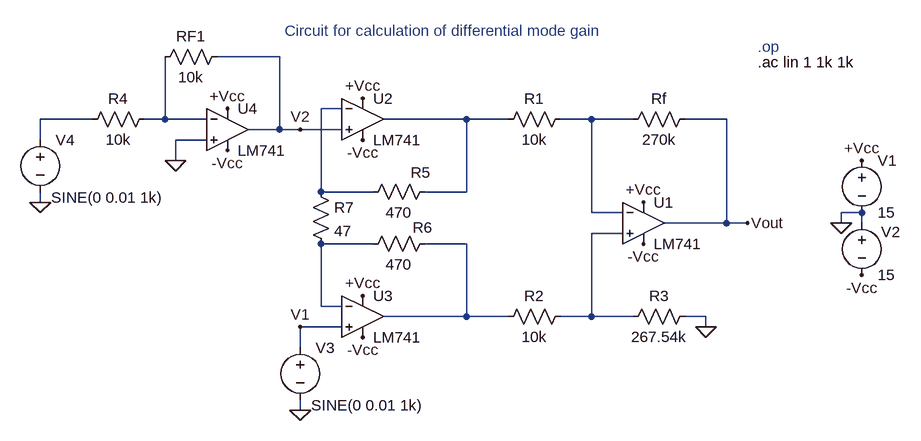
[diagram p0: schematic DMgain.asc]
DMgain.asc, the LTspice schematic file:
Version 4
SHEET 1 880 680
WIRE -384 -48 -480 -48
WIRE -288 32 -320 32
WIRE -672 48 -752 48
WIRE -560 48 -560 -48
WIRE -560 48 -592 48
WIRE -496 48 -560 48
WIRE -96 48 -224 48
WIRE -32 48 -96 48
WIRE 96 48 48 48
WIRE 160 48 96 48
WIRE 304 48 240 48
WIRE -384 64 -384 -48
WIRE -384 64 -432 64
WIRE -352 64 -384 64
WIRE -288 64 -352 64
WIRE -752 80 -752 48
WIRE -496 80 -544 80
WIRE -544 112 -544 80
WIRE -320 160 -320 32
WIRE -240 160 -320 160
WIRE -96 160 -96 48
WIRE -96 160 -160 160
WIRE -752 176 -752 160
WIRE 96 192 96 48
WIRE 144 192 96 192
WIRE 512 192 480 192
WIRE 304 208 304 48
WIRE 304 208 208 208
WIRE 336 208 304 208
WIRE 480 208 480 192
WIRE 512 208 512 192
WIRE 144 224 96 224
WIRE -240 240 -320 240
WIRE -96 240 -160 240
WIRE -320 336 -320 240
WIRE -288 336 -320 336
WIRE -96 352 -96 240
WIRE -96 352 -224 352
WIRE -32 352 -96 352
WIRE 96 352 96 224
WIRE 96 352 48 352
WIRE 160 352 96 352
WIRE 272 352 240 352
WIRE -288 368 -352 368
WIRE 272 368 272 352
WIRE -352 400 -352 368
WIRE -352 496 -352 480
FLAG 512 112 +Vcc
FLAG 512 288 -Vcc
FLAG 480 208 0
FLAG 272 368 0
FLAG 176 176 +Vcc
FLAG 176 240 -Vcc
FLAG 336 208 Vout
FLAG -256 16 +Vcc
FLAG -256 80 -Vcc
FLAG -256 320 +Vcc
FLAG -256 384 -Vcc
FLAG -352 496 0
FLAG -752 176 0
FLAG -464 32 +Vcc
FLAG -464 96 -Vcc
FLAG -544 112 0
FLAG -352 368 V1
FLAG -352 64 V2
SYMBOL voltage 512 96 R0
SYMATTR InstName V1
SYMATTR Value 15
SYMBOL voltage 512 192 R0
WINDOW 0 30 30 Left 2
SYMATTR InstName V2
SYMATTR Value 15
SYMBOL Opamps\\LM741 176 144 R0
SYMATTR InstName U1
SYMBOL res 64 32 R90
WINDOW 0 0 56 VBottom 2
WINDOW 3 32 56 VTop 2
SYMATTR InstName R1
SYMATTR Value 10k
SYMBOL res 64 336 R90
WINDOW 0 0 56 VBottom 2
WINDOW 3 32 56 VTop 2
SYMATTR InstName R2
SYMATTR Value 10k
SYMBOL res 256 336 R90
WINDOW 0 0 56 VBottom 2
WINDOW 3 32 56 VTop 2
SYMATTR InstName R3
SYMATTR Value 267.54k
SYMBOL res 256 32 R90
WINDOW 0 0 56 VBottom 2
WINDOW 3 32 56 VTop 2
SYMATTR InstName Rf
SYMATTR Value 270k
SYMBOL Opamps\\LM741 -256 -16 R0
SYMATTR InstName U2
SYMBOL Opamps\\LM741 -256 288 R0
SYMATTR InstName U3
SYMBOL res -144 144 R90
WINDOW 0 2 23 VBottom 2
WINDOW 3 32 56 VTop 2
SYMATTR InstName R5
SYMATTR Value 470
SYMBOL res -144 224 R90
WINDOW 0 6 20 VBottom 2
WINDOW 3 32 56 VTop 2
SYMATTR InstName R6
SYMATTR Value 470
SYMBOL res -336 144 R0
SYMATTR InstName R7
SYMATTR Value 47
SYMBOL voltage -352 384 R0
WINDOW 3 17 105 Left 2
WINDOW 39 0 0 Left 2
SYMATTR Value SINE(0 0.01 1k)
SYMATTR InstName V3
SYMATTR Value2 AC 0.01 0
SYMBOL voltage -752 64 R0
WINDOW 3 17 105 Left 2
WINDOW 39 0 0 Left 2
SYMATTR Value SINE(0 0.01 1k)
SYMATTR InstName V4
SYMATTR Value2 AC 0.01 0
SYMBOL Opamps\\LM741 -464 0 R0
SYMATTR InstName U4
SYMBOL res -464 -64 R90
WINDOW 0 0 56 VBottom 2
WINDOW 3 32 56 VTop 2
SYMATTR InstName RF1
SYMATTR Value 10k
SYMBOL res -576 32 R90
WINDOW 0 0 56 VBottom 2
WINDOW 3 32 56 VTop 2
SYMATTR InstName R4
SYMATTR Value 10k
TEXT 352 -64 Left 2 ;.op
TEXT 352 -40 Left 2 !.ac lin 1 1k 1k
TEXT -376 -88 Left 2 ;Circuit for calculation of differential mode gain

The netlist it stands for:
* DMgain.asc
V1 +Vcc 0 15
V2 0 -Vcc 15
XU1 N006 N005 +Vcc -Vcc Vout LM741  ; pins In+ In- V+ V- OUT
R1 N005 N004 10k
R2 N006 N008 10k
R3 0 N006 267.54k
Rf Vout N005 270k
XU2 V2 N001 +Vcc -Vcc N004 LM741  ; pins In+ In- V+ V- OUT
XU3 V1 N007 +Vcc -Vcc N008 LM741  ; pins In+ In- V+ V- OUT
R5 N004 N001 470
R6 N008 N007 470
R7 N001 N007 47
V3 V1 0 SINE(0 0.01 1k) AC 0.01 0
V4 N002 0 SINE(0 0.01 1k) AC 0.01 0
XU4 0 N003 +Vcc -Vcc V2 LM741  ; pins In+ In- V+ V- OUT
RF1 V2 N003 10k
R4 N003 N002 10k
* .op
.ac lin 1 1k 1k
* Circuit for calculation of differential mode gain
.lib LM741.lib
.backanno
.end